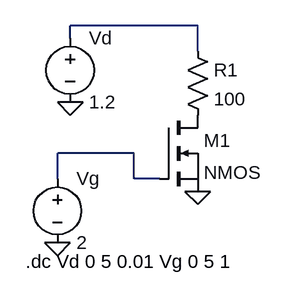
[diagram p0: schematic NMOS_output.asc]
NMOS_output.asc, the LTspice schematic file:
Version 4.1
SHEET 1 880 680
WIRE 288 32 128 32
WIRE 128 48 128 32
WIRE 288 64 288 32
WIRE 208 192 112 192
WIRE 112 224 112 192
WIRE 208 224 208 192
WIRE 240 224 208 224
FLAG 112 304 0
FLAG 128 128 0
FLAG 288 240 0
SYMBOL nmos 240 144 R0
SYMATTR InstName M1
SYMBOL res 272 48 R0
SYMATTR InstName R1
SYMATTR Value 100
SYMBOL voltage 128 32 R0
WINDOW 123 0 0 Left 0
WINDOW 39 0 0 Left 0
SYMATTR InstName Vd
SYMATTR Value 1.2
SYMBOL voltage 112 208 R0
WINDOW 123 0 0 Left 0
WINDOW 39 0 0 Left 0
SYMATTR InstName Vg
SYMATTR Value 2
TEXT 72 328 Left 2 !.dc Vd 0 5 0.01 Vg 0 5 1

The netlist it stands for:
* NMOS_output.asc
M1 P001 N002 0 0 NMOS
R1 N001 P001 100
Vd N001 0 1.2
Vg N002 0 2
.model NMOS NMOS
.model PMOS PMOS
.lib standard.mos
.dc Vd 0 5 0.01 Vg 0 5 1
.backanno
.end